# EAGLE board BlockBox (EAGLE 9.5.2), part 1 of 2
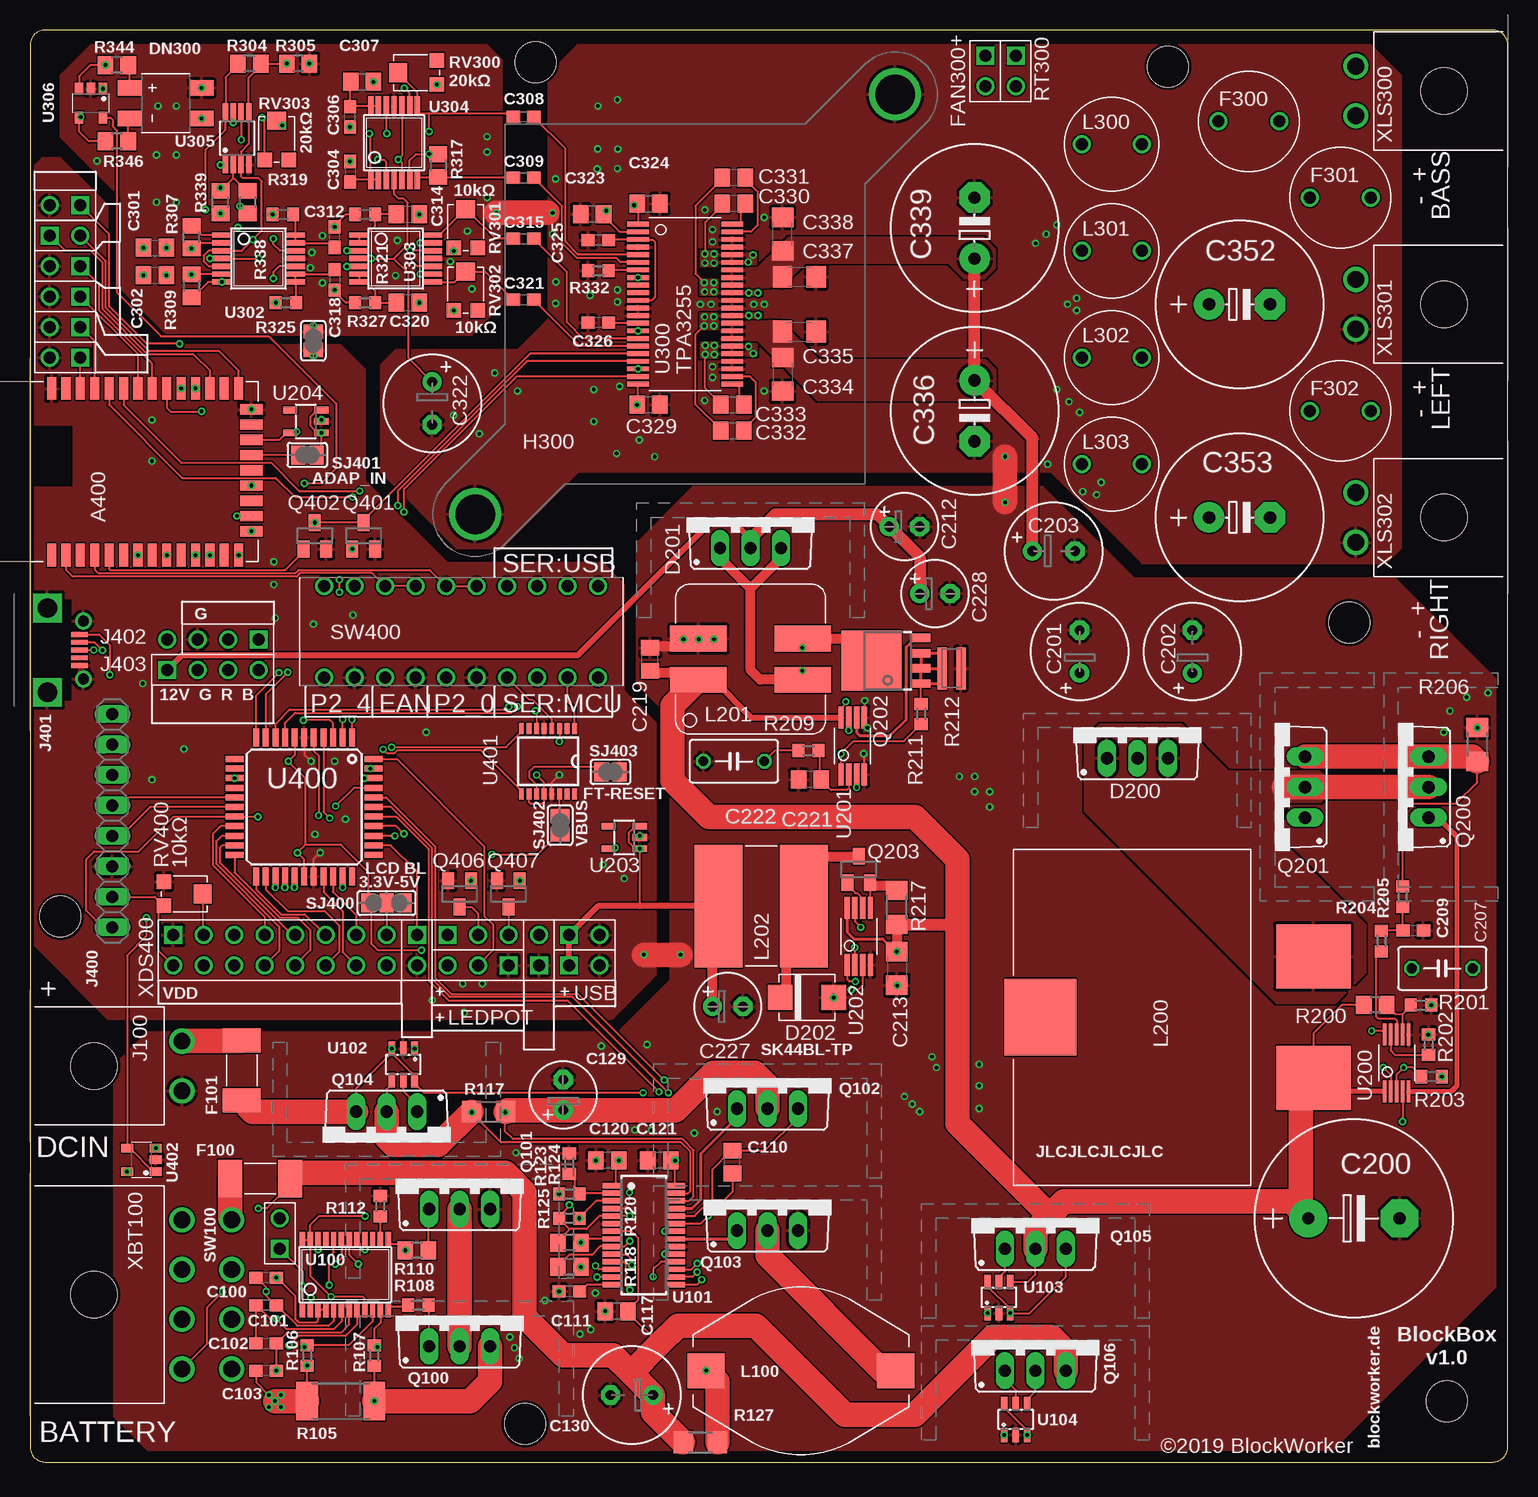
[diagram p5: board, top side]
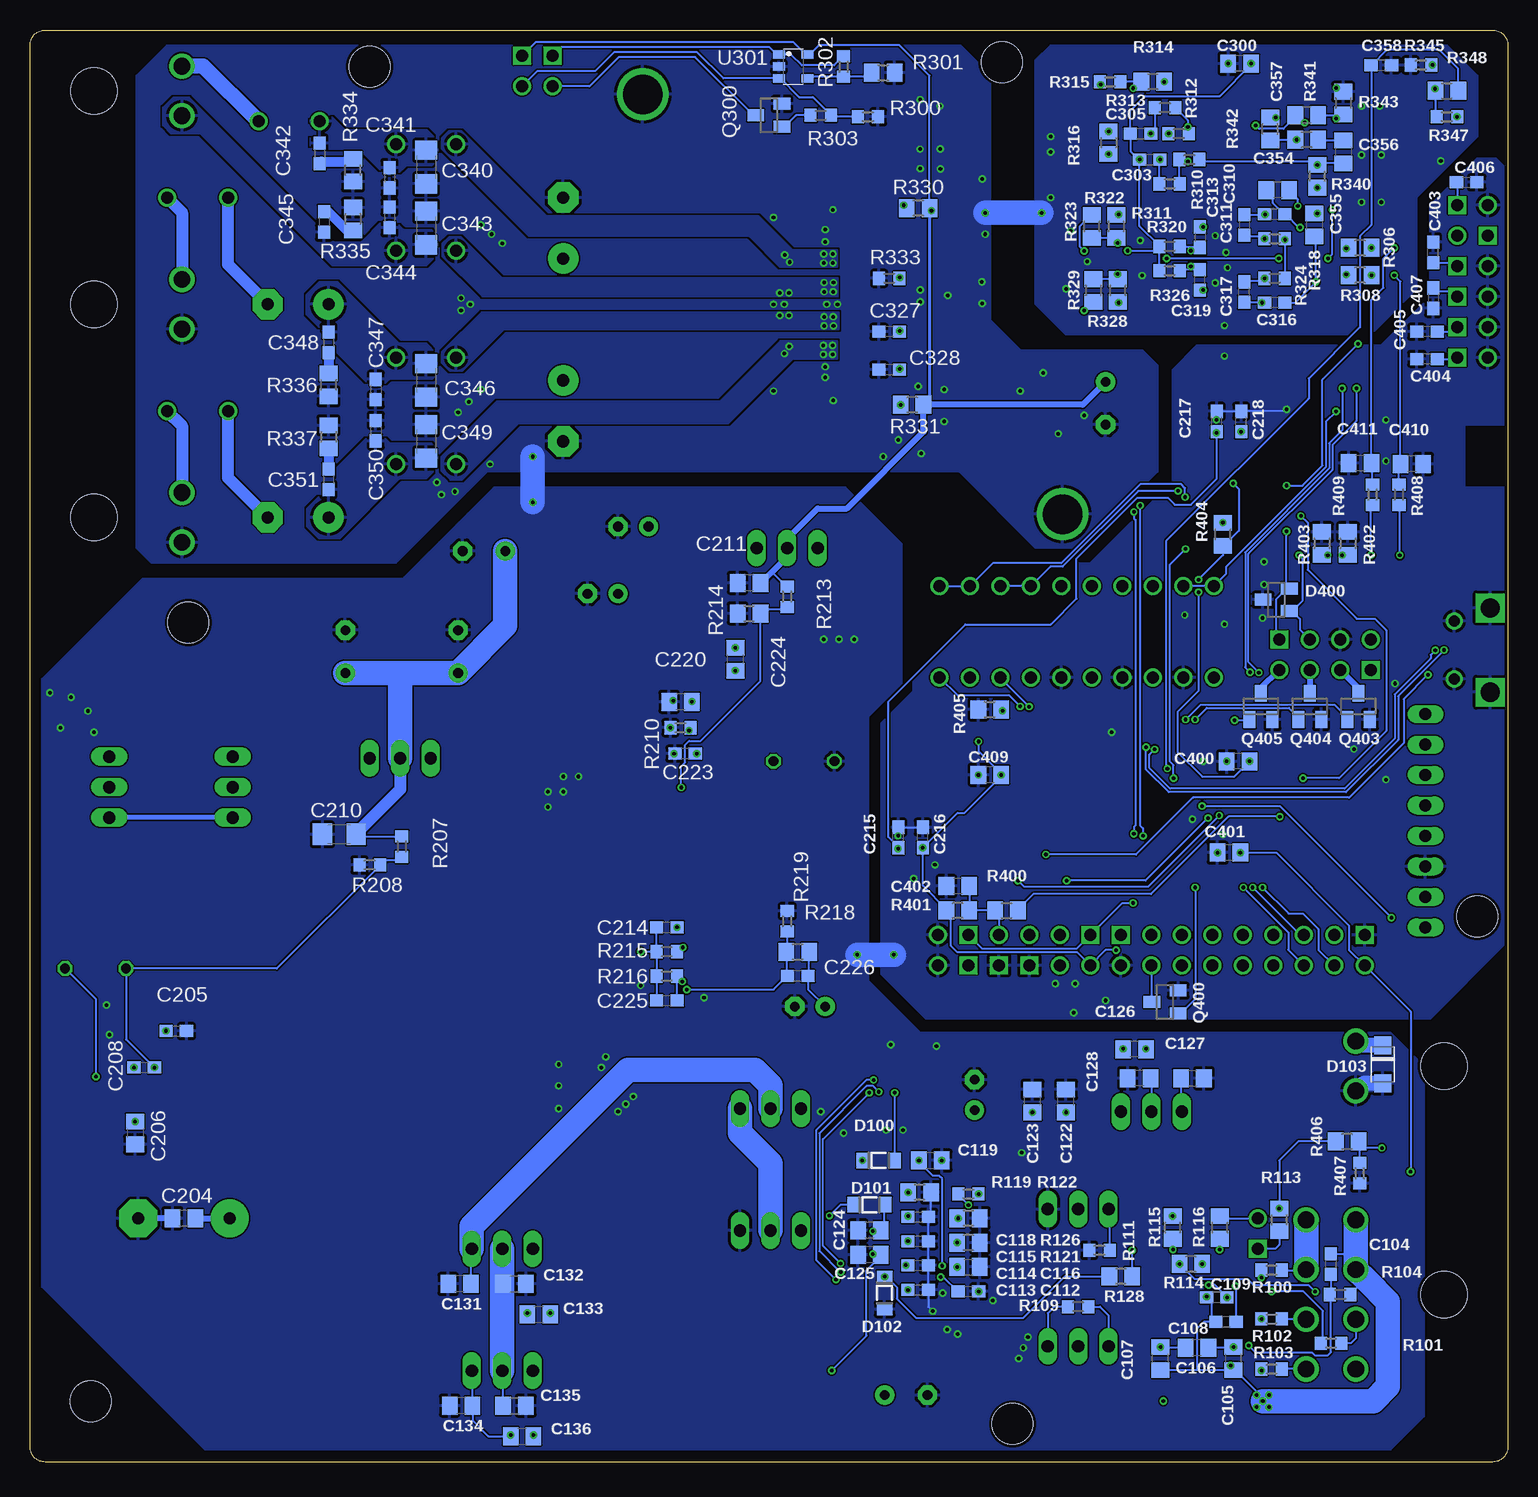
[diagram p6: board, bottom side, seen from below]

Size 123.19 x 119.38 mm. Coordinates in mm from the lower left corner, seen from the top.
Outline: 121.92,119.38 1.27,119.38 arc90 0,118.11 0,1.27 arc90 1.27,0 121.92,0 arc90 123.19,1.27 123.19,118.11 arc90 121.92,119.38
Copper layers (1*16): Top 0.035mm / dielectric 1.5mm / Bottom 0.035mm
Design rules "jlcpcb-2l": minimum track width 5mil, minimum drill 0.3mm, track to track 5mil, track to pad 5mil, pad to pad 5mil, via to via 5mil, smd to smd 0mil, copper to edge 0.25mm, drill to drill 6mil, minimum pad ring 6mil, minimum via ring 6mil, stop-mask expansion 4mil, vias tented up to drill 0.3mm, thermal gap 10mil
Holes 3.4 mm at 41.27,3.17 2.54,45.47 42.16,116.71 118.11,5.08 94.87,116.33 109.98,69.98

## Footprints (pad centres in the part's own frame; a part is rotated, then mirrored left to right if it is on the bottom)
BM62 = smd 1.9 x 0.76: 1 -6.95,-1.8; 2 -6.95,-3; 3 -6.95,-4.2; 4 -6.95,-5.4; 5 -6.95,-6.6; 6 -6.95,-7.8; 7 -6.95,-9; 8 -6.95,-10.2; 9 -6.95,-11.4; 10 -6.95,-12.6; 11 -6.95,-13.8; 12 -6.95,-15; 13 -6.95,-16.2; 14 -6.95,-17.4; 24 6.95,-17.4; 25 6.95,-16.2; 26 6.95,-15; 27 6.95,-13.8; 28 6.95,-12.6; 29 6.95,-11.4; 30 6.95,-10.2; 31 6.95,-9; 32 6.95,-7.8; 33 6.95,-6.6; 34 6.95,-5.4; 35 6.95,-4.2; 36 6.95,-3; 37 6.95,-1.8 | smd 0.85 x 1.9: 15 -4.96,-18.45; 16 -3.69,-18.45; 17 -2.42,-18.45; 18 -1.15,-18.45; 19 0.12,-18.45; 20 1.39,-18.45; 21 2.66,-18.45; 22 3.93,-18.45; 23 5.2,-18.45
C0603 = smd 1.1 x 1: 1 -0.85,0; 2 0.85,0
C0805 = smd 1.3 x 1.5: 1 -0.95,0; 2 0.95,0
E2,5-6 = drill 0.813 pad 1.6: + -1.27,0 | drill 0.813 pad 1.6 octagon: - 1.27,0
E3,5-8 = drill 0.813 pad 1.6: + -1.778,0 | drill 0.813 pad 1.6 octagon: - 1.778,0
E7,5-16 = drill 1.016 pad 3.15: + -3.81,0 | drill 1.016 pad 3.15 octagon: - 3.81,0
C050-035X075 = drill 0.813 octagon: 1 -2.54,0; 2 2.54,0
C1206 = smd 1.6 x 1.8: 1 -1.4,0; 2 1.4,0
E5-13 = drill 1.016 pad 2.54: + -2.54,0 | drill 1.016 pad 2.54 octagon: - 2.54,0
SOD323 = smd 1 x 1.3: 1 -1.35,0; 2 1.35,0
DO-219AB = smd 1.5 x 1.4: A -1.6,0; K 1.6,0
TO220ABS = drill 1.016 long: A1 -2.54,-2.54; A2 2.54,-2.54; C 0,-2.54
DO-214AA = smd 2.032 x 2.108: A -2.235,0; K 2.235,0
SOT23 = smd 1 x 1.4: 1 -0.95,-1.1; 2 0.95,-1.1; 3 0,1.1
MD-S-4 = smd 2 x 1.27: + 3,-1.27; - 3,1.27; ~1 -3,1.27; ~2 -3,-1.27
F2410 = smd 2 x 3.15: 1 -2.5,0; 2 2.5,0
MRF_FUSE = drill 1: 1 -2.54,0; 2 2.54,0
WIRE-2P-SIMPLE = drill 1 square: 1 -1.27,0 | drill 1: 2 1.27,0
ATS-CPX030030030-173-C2-R0 = drill 3.3: H1 17.5,17.5; H2 -17.5,-17.5
TE-770966 = drill 1.4: 1 -2.07,12.67; 2 2.07,12.67 | hole 3.86: 0,5.33
1X08 = drill 1 long: 1 -8.89,0; 2 -6.35,0; 3 -3.81,0; 4 -1.27,0; 5 1.27,0; 6 3.81,0; 7 6.35,0; 8 8.89,0
ZX62D-B-5PA8 = smd 0.4 x 1.35: 1 3.4,4.125; 2 4.05,4.125; 3 4.7,4.125; 4 5.35,4.125; 5 6,4.125 | drill 1.6 pad 2.375 square: S1 1.188,1.45; S2 8.213,1.45 | drill 0.9 pad 1.4: S3 2.275,4.45; S4 7.125,4.45
3PIN = drill 1 square: 1 -2.54,0 | drill 1: 2 0,0; 3 2.54,0
4PIN = drill 1 square: 1 -3.81,0 | drill 1: 2 -1.27,0; 3 1.27,0; 4 3.81,0
2PIN = drill 1 square: 1 -1.27,0 | drill 1: 2 1.27,0
PM5022 = smd 3.1 x 2.9: 1 -7.9,0; 2 7.9,0
PQ2614B = smd 5.33 x 6.2: 1 -5.075,-14.66; 2 5.075,-14.66 | smd 6.35 x 6: M 0,8.08
SRF1280A = smd 2.15 x 4.7: 1 -1.715,4.35; 2 1.715,4.35; 3 1.715,-4.35; 4 -1.715,-4.35
SRN1060 = smd 4 x 10.2: 1 -3.55,0; 2 3.55,0
RCH8011 = drill 1: 1 -2.5,0; 2 2.5,0
TO220BV = drill 1.016 long: D 0,-2.54; G -2.54,-2.54; S 2.54,-2.54
SOT669 = smd 0.7 x 1.6: 1 -1.905,-2.75; 2 -0.635,-2.75; 3 0.635,-2.75; 4 1.905,-2.75 | smd 5 x 5: MB 0,1.35
R0603 = smd 1 x 1.1: 1 -0.85,0; 2 0.85,0
R2512 = smd 1.8 x 3.2: 1 -2.8,0; 2 2.8,0
R0805 = smd 1.3 x 1.5: 1 -0.95,0; 2 0.95,0
R1206 = smd 1.6 x 1.803: 1 -1.422,0; 2 1.422,0
R0612 = smd 0.8 x 3.5: 1 -0.78,0; 2 0.78,0
TC33X-2 = smd 1.2 x 1.2: 1 -1,-1.8; 3 1,-1.8 | smd 1.6 x 1.5: 2 0,1.45
WIRE-3P-SIMPLE = drill 1 square: 1 -2.54,0 | drill 1: 2 0,0; 3 2.54,0
SJ_2 = smd 1.168 x 1.6: 1 -1.524,0; 2 0,0; 3 1.524,0
SJ = smd 1.168 x 1.6: 1 -0.762,0; 2 0.762,0
DIPSW-10 = drill 1: A1 -11.43,-3.81; A2 -8.89,-3.81; A3 -6.35,-3.81; A4 -3.81,-3.81; A5 -1.27,-3.81; A6 1.27,-3.81; A7 3.81,-3.81; A8 6.35,-3.81; A9 8.89,-3.81; A10 11.43,-3.81; B1 -11.43,3.81; B2 -8.89,3.81; B3 -6.35,3.81; B4 -3.81,3.81; B5 -1.27,3.81; B6 1.27,3.81; B7 3.81,3.81; B8 6.35,3.81; B9 8.89,3.81; B10 11.43,3.81
TSSOP24 = smd 0.45 x 1.3: 1 -3.575,-2.918; 2 -2.925,-2.918; 3 -2.275,-2.918; 4 -1.625,-2.918; 5 -0.975,-2.918; 6 -0.325,-2.918; 7 0.325,-2.918; 8 0.975,-2.918; 9 1.625,-2.918; 10 2.275,-2.918; 11 2.925,-2.918; 12 3.575,-2.918; 13 3.575,2.918; 14 2.925,2.918; 15 2.275,2.918; 16 1.625,2.918; 17 0.975,2.918; 18 0.325,2.918; 19 -0.325,2.918; 20 -0.975,2.918; 21 -1.625,2.918; 22 -2.275,2.918; 23 -2.925,2.918; 24 -3.575,2.918
QSOP28 = smd 0.45 x 1.5: 1 -4.128,-2.69; 2 -3.493,-2.69; 3 -2.857,-2.69; 4 -2.223,-2.69; 5 -1.587,-2.69; 6 -0.953,-2.69; 7 -0.318,-2.69; 8 0.318,-2.69; 9 0.953,-2.69; 10 1.587,-2.69; 11 2.223,-2.69; 12 2.857,-2.69; 13 3.493,-2.69; 14 4.128,-2.69; 15 4.128,2.69; 16 3.493,2.69; 17 2.857,2.69; 18 2.223,2.69; 19 1.587,2.69; 20 0.953,2.69; 21 0.318,2.69; 22 -0.318,2.69; 23 -0.953,2.69; 24 -1.587,2.69; 25 -2.223,2.69; 26 -2.857,2.69; 27 -3.493,2.69; 28 -4.128,2.69
SOT23-6L = smd 0.55 x 1.2: 1 -0.95,-1.3; 2 0,-1.3; 3 0.95,-1.3; 4 0.95,1.3; 5 0,1.3; 6 -0.95,1.3
VSSOP10 = smd 1.8 x 0.3: 1 -2.375,1; 2 -2.375,0.5; 3 -2.375,0; 4 -2.375,-0.5; 5 -2.375,-1; 6 2.375,-1; 7 2.375,-0.5; 8 2.375,0; 9 2.375,0.5; 10 2.375,1
VSSOP8 = smd 1.8 x 0.45: 1 -2.375,0.975; 2 -2.375,0.325; 3 -2.375,-0.325; 4 -2.375,-0.975; 5 2.375,-0.975; 6 2.375,-0.325; 7 2.375,0.325; 8 2.375,0.975
SOT23-5L = smd 0.55 x 1.2: 1 -0.95,-1.3; 2 0,-1.3; 3 0.95,-1.3; 4 0.95,1.3; 5 -0.95,1.3
TSSOP44 = smd 1.8 x 0.4: 1 -3.925,6.668; 2 -3.925,6.032; 3 -3.925,5.397; 4 -3.925,4.763; 5 -3.925,4.128; 6 -3.925,3.493; 7 -3.925,2.857; 8 -3.925,2.223; 9 -3.925,1.587; 10 -3.925,0.953; 11 -3.925,0.318; 12 -3.925,-0.318; 13 -3.925,-0.953; 14 -3.925,-1.587; 15 -3.925,-2.223; 16 -3.925,-2.857; 17 -3.925,-3.493; 18 -3.925,-4.128; 19 -3.925,-4.763; 20 -3.925,-5.397; 21 -3.925,-6.032; 22 -3.925,-6.668; 23 3.925,-6.668; 24 3.925,-6.032; 25 3.925,-5.397; 26 3.925,-4.763; 27 3.925,-4.128; 28 3.925,-3.493; 29 3.925,-2.857; 30 3.925,-2.223; 31 3.925,-1.587; 32 3.925,-0.953; 33 3.925,-0.318; 34 3.925,0.318; 35 3.925,0.953; 36 3.925,1.587; 37 3.925,2.223; 38 3.925,2.857; 39 3.925,3.493; 40 3.925,4.128; 41 3.925,4.763; 42 3.925,5.397; 43 3.925,6.032; 44 3.925,6.668
TSOP-5 = smd 0.7 x 1: 1 -0.99,-1.2; 2 0,-1.2; 3 0.99,-1.2; 4 0.99,1.2; 5 -0.99,1.2
TSSOP14 = smd 0.45 x 1.65: 1 -1.95,-3.05; 2 -1.3,-3.05; 3 -0.65,-3.05; 4 0,-3.05; 5 0.65,-3.05; 6 1.3,-3.05; 7 1.95,-3.05; 8 1.95,3.05; 9 1.3,3.05; 10 0.65,3.05; 11 0,3.05; 12 -0.65,3.05; 13 -1.3,3.05; 14 -1.95,3.05
MSOP8 = smd 0.45 x 1.45: 1 -0.975,-2.2; 2 -0.325,-2.2; 3 0.325,-2.2; 4 0.975,-2.2; 5 0.975,2.2; 6 0.325,2.2; 7 -0.325,2.2; 8 -0.975,2.2
TQFP44 = smd 1.5 x 0.5: 1 -5.8,4; 2 -5.8,3.2; 3 -5.8,2.4; 4 -5.8,1.6; 5 -5.8,0.8; 6 -5.8,0; 7 -5.8,-0.8; 8 -5.8,-1.6; 9 -5.8,-2.4; 10 -5.8,-3.2; 11 -5.8,-4; 23 5.8,-4; 24 5.8,-3.2; 25 5.8,-2.4; 26 5.8,-1.6; 27 5.8,-0.8; 28 5.8,0; 29 5.8,0.8; 30 5.8,1.6; 31 5.8,2.4; 32 5.8,3.2; 33 5.8,4 | smd 0.5 x 1.5: 12 -4,-5.8; 13 -3.2,-5.8; 14 -2.4,-5.8; 15 -1.6,-5.8; 16 -0.8,-5.8; 17 0,-5.8; 18 0.8,-5.8; 19 1.6,-5.8; 20 2.4,-5.8; 21 3.2,-5.8; 22 4,-5.8; 34 4,5.8; 35 3.2,5.8; 36 2.4,5.8; 37 1.6,5.8; 38 0.8,5.8; 39 0,5.8; 40 -0.8,5.8; 41 -1.6,5.8; 42 -2.4,5.8; 43 -3.2,5.8; 44 -4,5.8
SSOP16 = smd 0.914 x 0.406: 1 -2.718,2.223; 2 -2.718,1.587; 3 -2.718,0.953; 4 -2.718,0.318; 5 -2.718,-0.318; 6 -2.718,-0.953; 7 -2.718,-1.587; 8 -2.718,-2.223; 9 2.718,-2.223; 10 2.718,-1.587; 11 2.718,-0.953; 12 2.718,-0.318; 13 2.718,0.318; 14 2.718,0.953; 15 2.718,1.587; 16 2.718,2.223
TE-770970 = drill 1.4: 1 -6.21,16.81; 2 -2.07,16.81; 3 2.07,16.81; 4 6.21,16.81; 5 -6.21,12.67; 6 -2.07,12.67; 7 2.07,12.67; 8 6.21,12.67 | hole 3.86: 0,5.33
2X8PIN = drill 1 square: 1 -8.89,1.27 | drill 1: 2 -8.89,-1.27; 3 -6.35,1.27; 4 -6.35,-1.27; 5 -3.81,1.27; 6 -3.81,-1.27; 7 -1.27,1.27; 8 -1.27,-1.27; 9 1.27,1.27; 10 1.27,-1.27; 11 3.81,1.27; 12 3.81,-1.27; 13 6.35,1.27; 14 6.35,-1.27; 15 8.89,1.27; 16 8.89,-1.27

## Placement (x,y rotation side)
A400  BM62  [BM62]  0,82.55 90 top
C100  1µF  [C0603]  19.68,15.37 180 top
C101  1µF  [C0603]  19.68,13.08 180 top
C102  1µF  [C0603]  19.68,9.91 0 top
C103  1µF  [C0603]  19.68,7.62 180 top
C104  1µF  [C0603]  14.73,16.51 90 bottom
C105  0.1µF  [C0805]  22.86,8.64 90 bottom
C106  0.1µF  [C0805]  25.91,9.53 180 bottom
C107  0.1µF  [C0805]  28.96,8.64 90 bottom
C108  1µF  [C0603]  23.5,11.68 180 bottom
C109  1µF  [C0603]  24.26,13.72 180 bottom
C110  0.1µF  [C0805]  58.55,25.02 90 top
C111  2.2nF  [C0603]  44.96,14.22 180 top
C112  2.2nF  [C0603]  44.96,14.22 0 bottom
C113  47nF  [C0603]  49.15,14.35 0 bottom
C114  47nF  [C0603]  49.15,16.38 0 bottom
C115  1nF  [C0603]  49.15,18.41 0 bottom
C116  0.1µF  [C0805]  44.96,16.26 0 bottom
C117  0.1µF  [C0805]  48.9,12.57 180 top
C118  1µF  [C0603]  49.15,20.45 0 bottom
C119  0.1µF  [C0805]  48.13,25.15 0 bottom
C120  4.7µF  [C0805]  48.13,25.15 180 top
C121  0.1µF  [C0805]  52.45,25.15 180 top
C122  0.1µF  [C0805]  36.83,30.1 90 bottom
C123  0.1µF  [C0805]  39.62,30.1 90 bottom
C124  0.1µF  [C0805]  53.21,19.3 180 bottom
C125  0.1µF  [C0805]  53.21,17.27 180 bottom
C126  0.1µF  [C0805]  31.11,34.42 180 bottom
C127  0.1µF  [C0805]  26.29,32 0 bottom
C128  0.1µF  [C0805]  30.73,32 180 bottom
C129  47µF  [E2,5-6]  44.45,30.61 90 top
C130  220µF  [E3,5-8]  50.16,5.59 180 top
C131  0.1µF  [C0805]  87.38,14.86 180 bottom
C132  0.1µF  [C0805]  82.8,14.86 0 bottom
C133  0.1µF  [C0805]  80.77,12.32 0 bottom
C134  0.1µF  [C0805]  87.25,4.7 180 bottom
C135  0.1µF  [C0805]  82.8,4.7 0 bottom
C136  0.1µF  [C0805]  82.17,2.16 0 bottom
C200  1mF  [E7,5-16]  110.36,20.32 0 top
C201  33µF  [E3,5-8]  87.5,67.56 90 top
C202  33µF  [E3,5-8]  96.9,67.56 90 top
C203  33µF  [E3,5-8]  85.34,75.95 0 top
C204  0.1µF  [C0805]  110.36,20.32 180 bottom
C205  8.2nF  [C0603]  111,35.94 0 bottom
C206  0.1µF  [C0805]  114.43,27.43 270 bottom
C207  0.33µF  [C050-035X075]  117.73,41.15 180 top
C208  8.2nF C0G  [C0603]  113.67,32.89 0 bottom
C209  1nF  [C0603]  115.32,44.32 0 top
C210  1µF 100V  [C1206]  97.41,52.32 180 bottom
C211  0.1µF  [C0805]  63.25,73.28 180 bottom
C212  47µF  [E2,5-6]  72.9,77.98 0 top
C213  10µF 35V  [C1206]  72.26,41.15 270 top
C214  0.47µF  [C0603]  70.1,44.58 0 bottom
C215  1µF  [C0603]  50.8,52.07 90 bottom
C216  1µF  [C0603]  48.77,52.07 90 bottom
C217  1µF  [C0603]  24.26,86.74 90 bottom
C218  1µF  [C0603]  22.23,86.74 90 bottom
C219  4.7µF  [C0805]  51.69,66.93 90 top
C220  0.1µF  [C0805]  68.96,63.37 180 bottom
C221  12nF  [C0805]  65.02,56.9 180 top
C222  0.33µF  [C050-035X075]  58.67,58.42 180 top
C223  910pF  [C0603]  68.58,59.05 180 bottom
C224  4.7µF  [C0805]  64.39,66.93 90 bottom
C225  1nF  [C0603]  70.1,38.48 0 bottom
C226  1nF  [C0603]  59.18,40.51 180 bottom
C227  47µF  [E2,5-6]  58.17,37.97 0 top
C228  47µF  [E2,5-6]  75.44,72.39 0 top
C300  10µF  [C0805]  22.35,116.59 180 bottom
C301  10µF  [C0805]  10.41,101.22 0 top
C302  10µF  [C0805]  10.41,98.93 0 top
C303  330pF  [C0603]  29.84,108.58 0 bottom
C304  1nF  [C0603]  26.67,107.57 270 top
C305  100pF  [C0603]  30.61,110.74 0 bottom
C306  1nF  [C0603]  26.67,112.14 90 top
C307  10µF  [C0805]  27.69,115.06 0 top
C308  10µF  [C0603]  41.15,112.14 0 top
C309  10µF  [C0603]  41.15,107.06 0 top
C310  330pF  [C0603]  19.43,104.01 180 bottom
C311  1nF  [C0603]  21.97,103.12 270 bottom
C312  330pF  [C0603]  25.4,102.11 90 top
C313  1nF  [C0603]  25.65,102.11 270 bottom
C314  10µF  [C0805]  31.5,104.01 0 top
C315  10µF  [C0603]  41.15,101.98 0 top
C316  330pF  [C0603]  19.43,96.65 180 bottom
C317  1nF  [C0603]  21.97,97.54 90 bottom
C318  330pF  [C0603]  25.4,98.55 270 top
C319  1nF  [C0603]  25.65,98.55 90 bottom
C320  10µF  [C0805]  31.5,96.65 0 top
C321  10µF  [C0603]  41.15,96.9 0 top
C322  470µF  [E3,5-8]  33.53,88.27 270 top
C323  0.1µF  [C0805]  46.86,104.01 180 top
C324  0.1µF  [C0805]  51.56,104.9 0 top
C325  1µF  [C0603]  47.37,101.85 180 top
C326  1µF  [C0603]  47.37,95 180 top
C327  1µF  [C0603]  51.56,94.23 180 bottom
C328  1µF  [C0603]  51.56,91.06 180 bottom
C329  0.1µF  [C0805]  51.56,88.14 0 top
C330  33nF  [C0805]  58.67,104.9 180 top
C331  33nF  [C0805]  58.67,107.06 180 top
C332  33nF  [C0805]  58.55,85.98 0 top
C333  33nF  [C0805]  58.55,88.14 0 top
C334  1µF 100V .5  [C1206]  62.74,90.68 270 top
C335  1µF 100V .5  [C1206]  64.14,94.23 0 top
C336  470µF 80V  [E5-13]  78.74,87.63 270 top
C337  1µF 100V .5  [C1206]  64.14,98.81 0 top
C338  1µF 100V .5  [C1206]  62.74,102.36 90 top
C339  470µF 80V  [E5-13]  78.74,102.87 90 top
C340  1µF 100V  [C1206]  90.17,107.95 270 bottom
C341  1nF 100V  [C0603]  93.22,107.06 270 bottom
C342  10nF  [C0603]  99.06,109.09 270 bottom
C343  1µF 100V  [C1206]  90.17,102.87 270 bottom
C344  1nF 100V  [C0603]  93.22,103.76 270 bottom
C345  10nF  [C0603]  98.68,103.38 270 bottom
C346  1µF 100V  [C1206]  90.17,90.17 270 bottom
C347  1nF 100V  [C0603]  94.36,89.41 270 bottom
C348  10nF  [C0603]  98.3,93.34 270 bottom
C349  1µF 100V  [C1206]  90.17,85.09 270 bottom
C350  1nF 100V  [C0603]  94.36,85.98 270 bottom
C351  10nF  [C0603]  98.3,81.92 270 bottom
C352  470µF 80V  [E5-13]  100.84,96.52 0 top
C353  470µF 80V  [E5-13]  100.84,78.74 0 top
C354  10µF  [C0805]  19.18,106.05 180 bottom
C355  10µF  [C0805]  16.13,103.12 270 bottom
C356  10µF  [C0805]  13.72,109.22 270 bottom
C357  10µF  [C0805]  16.76,112.27 180 bottom
C358  2.2µF  [C0603]  10.54,116.46 0 bottom
C400  0.1µF  [C0805]  22.48,58.42 180 bottom
C401  0.1µF  [C0805]  23.24,50.8 180 bottom
C402  0.1µF  [C0805]  45.85,48.01 180 bottom
C403  15pF  [C0603]  6.22,100.84 90 bottom
C404  15pF  [C0603]  6.73,91.95 180 bottom
C405  15pF  [C0603]  6.73,94.23 180 bottom
C406  15pF  [C0603]  3.43,106.68 0 bottom
C407  15pF  [C0603]  6.22,97.03 270 bottom
C409  0.1µF  [C0805]  43.18,57.28 180 bottom
C410  0.1µF?  [C0805]  8,83.21 180 bottom
C411  0.1µF?  [C0805]  12.32,83.26 180 bottom
D100  NSR0530H  [SOD323]  52.45,25.15 0 bottom
D101  NSR0530H  [SOD323]  53.21,21.46 0 bottom
D102  3.9V  [SOD323]  51.94,14.1 270 bottom
D103  SMF28A-M3  [DO-219AB]  10.41,33.15 90 bottom
D200  STPS20M100ST  [TO220ABS]  92.33,61.21 0 top
D201  RB085T-60HZC9  [TO220ABS]  60.07,78.74 0 top
D202  SK44BL-TP  [DO-214AA]  64.77,38.73 180 top
D400  D5V0L2B3SO  [SOT23]  19.3,71.88 90 bottom
DN300  MD_S  [MD-S-4]  11.3,113.28 180 top
F100  15A  [F2410]  19.18,23.62 0 top
F101  10A  [F2410]  17.65,32.64 270 top
F300  2A  [MRF_FUSE]  101.6,111.76 0 top
F301  1A  [MRF_FUSE]  109.22,105.41 0 top
F302  1A  [MRF_FUSE]  109.22,87.63 0 top
FAN300  12V <50mA  [WIRE-2P-SIMPLE]  79.63,115.95 270 top
H300  ATS-CPX030030030-173-C2-R0  [ATS-CPX030030030-173-C2-R0]  54.61,96.52 0 top
J100  TE-770966  [TE-770966]  0,33.02 270 top
J400  ICSP  [1X08]  6.86,53.47 90 top
J401  ZX62D-B-5PA8  [ZX62D-B-5PA8]  0,72.39 270 top
J402  AUX  [3PIN]  16.51,68.58 180 top
J403  LED  [4PIN]  15.24,66.04 0 top
J404  SWLED  [3PIN]  37.34,43.94 0 top
J405  USB1  [2PIN]  46.23,43.94 0 top
J406  USB2  [2PIN]  46.23,41.4 0 top
L100  10µH  [PM5022]  64.26,7.62 180 top
L200  10µH  [PQ2614B]  92.33,37.08 90 top
L201  22/88µF  [SRF1280A]  60.07,66.93 90 top
L202  10µH  [SRN1060]  60.96,46.35 180 top
L300  10µH  [RCH8011]  90.17,109.86 0 top
L301  10µH  [RCH8011]  90.17,100.97 0 top
L302  15µH  [RCH8011]  90.17,92.08 0 top
L303  15µH  [RCH8011]  90.17,83.19 0 top
Q100  TK3R1E04PL  [TO220BV]  35.81,12.19 0 top
Q101  TK3R1E04PL  [TO220BV]  35.81,23.62 0 top
Q102  IPP052N06L3 G  [TO220BV]  61.47,32 0 top
Q103  IPP052N06L3 G  [TO220BV]  61.47,21.84 0 top
Q104  IPP052N06L3 G  [TO220BV]  29.72,26.67 180 top
Q105  IPP052N06L3 G  [TO220BV]  83.82,20.32 0 top
Q106  TK3R1E04PL  [TO220BV]  83.82,10.16 0 top
Q200  IRFB4510PBF  [TO220BV]  114.05,56.26 90 top
Q201  IRFB4510PBF  [TO220BV]  103.76,56.26 90 top
Q202  BUK9Y43-60E  [SOT669]  71.5,66.8 90 top
Q203  DMP4065S  [SOT23]  69.09,49.4 0 top
Q300  NMOS  [SOT23]  61.59,112.27 90 bottom
Q400  NMOS  [SOT23]  28.57,38.35 90 bottom
Q401  NMOS  [SOT23]  27.81,77.22 0 top
Q402  NMOS  [SOT23]  23.75,77.22 0 top
Q403  DMG2302UK  [SOT23]  12.45,62.99 0 bottom
Q404  DMG2302UK  [SOT23]  16.51,62.99 0 bottom
Q405  DMG2302UK  [SOT23]  20.57,62.99 0 bottom
Q406  NMOS  [SOT23]  35.81,47.37 180 top
Q407  NMOS  [SOT23]  39.88,47.37 180 top
R100  33Ω  [R0603]  19.68,16 180 bottom
R101  33Ω  [R0603]  14.73,9.91 180 bottom
R102  33Ω  [R0603]  19.68,11.94 180 bottom
R103  33Ω  [R0603]  19.68,7.75 180 bottom
R104  33Ω  [R0603]  13.97,13.97 180 bottom
R105  2mΩ  [R2512]  25.91,5.08 0 top
R106  100Ω  [R0603]  23.11,8.89 90 top
R107  100Ω  [R0603]  28.7,8.89 90 top
R108  4.53kΩ  [R0603]  32.38,13.08 180 top
R109  1MΩ  [R0603]  35.81,12.95 0 bottom
R110  1kΩ  [R0805]  32.26,17.65 180 top
R111  1MΩ  [R0603]  34.04,17.65 0 bottom
R112  470kΩ  [R0603]  29.21,21.34 270 top
R113  1kΩ  [R0805]  19.05,20.19 90 bottom
R114  10kΩ  [R0805]  26.42,16.51 180 bottom
R115  10kΩ  [R0805]  27.94,19.56 90 bottom
R116  10kΩ  [R0805]  24,19.56 90 bottom
R117  5mΩ  [R1206]  38.23,29.21 180 top
R118  10kΩ  [R0805]  44.96,16.26 180 top
R119  10kΩ  [R0805]  49.02,22.48 180 bottom
R120  100kΩ  [R0805]  44.96,18.29 180 top
R121  100kΩ  [R0805]  44.96,18.29 180 bottom
R122  20kΩ  [R0603]  44.96,22.35 180 bottom
R123  30kΩ  [R0603]  44.96,22.35 180 top
R124  30kΩ  [R0603]  44.96,24.89 270 top
R125  30kΩ  [R0603]  44.96,20.32 180 top
R126  10kΩ  [R0805]  44.96,20.32 180 bottom
R127  10mΩ  [R1206]  55.88,1.65 180 top
R128  10kΩ  [R0805]  32.26,15.49 180 bottom
R200  10kΩ  [R0805]  112.14,38.1 180 top
R201  1.69kΩ  [R0603]  115.95,38.1 180 top
R202  86.6kΩ  [R0603]  116.59,34.8 270 top
R203  237Ω  [R0603]  116.84,32.13 0 top
R204  3.57kΩ  [R0603]  112.65,43.43 90 top
R205  100Ω  [R0603]  114.43,47.12 90 top
R206  8mΩ  [R1206]  120.65,59.82 270 top
R207  23.2kΩ  [R0603]  92.2,51.31 90 bottom
R208  576Ω  [R0603]  94.87,49.78 0 bottom
R209  324Ω  [R0603]  64.9,59.31 0 top
R210  48.7kΩ  [R0603]  68.96,61.21 180 bottom
R211  100Ω  [R0603]  74.3,62.36 90 top
R212  15mΩ  [R0612]  76.83,66.17 180 top
R213  84.5kΩ  [R0603]  60.07,72.14 90 bottom
R214  10kΩ  [R0805]  63.25,70.74 0 bottom
R215  44.2kΩ  [R0603]  70.1,42.55 180 bottom
R216  1.43kΩ  [R0603]  70.1,40.51 180 bottom
R217  10mΩ  [R1206]  72.26,46.23 270 top
R218  10kΩ  [R0805]  59.18,42.55 0 bottom
R219  3.32kΩ  [R0603]  60.07,45.09 270 bottom
R300  510Ω  [R0603]  53.34,112.14 180 bottom
R301  10kΩ  [R0805]  52.07,115.82 0 bottom
R302  39kΩ  [R0603]  55.37,116.33 90 bottom
R303  47Ω?  [R0603]  57.28,112.27 180 bottom
R304  10kΩ  [R0805]  18.29,116.59 180 top
R305  10kΩ  [R0805]  22.35,116.59 180 top
R306  10kΩ  [R0805]  12.32,101.22 180 bottom
R307  10kΩ  [R0805]  13.46,102.11 90 top
R308  10kΩ  [R0805]  12.32,98.93 180 bottom
R309  10kΩ  [R0805]  13.46,98.04 270 top
R310  200kΩ  [R0603]  26.54,108.58 180 bottom
R311  24.3kΩ  [R0603]  28.19,106.55 180 bottom
R312  237kΩ  [R0603]  27.43,110.74 0 bottom
R313  66.5kΩ  [R0603]  28.57,112.9 180 bottom
R314  10kΩ  [R0805]  29.59,115.06 180 bottom
R315  4.53kΩ  [R0603]  33.15,115.06 180 bottom
R316  10kΩ  [R0805]  33.27,109.98 270 bottom
R317  10kΩ  [R0805]  34.04,108.08 270 top
R318  86.6kΩ  [R0603]  19.43,101.98 180 bottom
R319  54.9kΩ  [R0603]  21.08,104.01 0 top
R320  210kΩ  [R0603]  28.19,101.35 0 bottom
R321  22.6kΩ  [R0603]  27.94,104.01 0 top
R322  10kΩ  [R0805]  32.64,103 270 bottom
R323  10kΩ  [R0805]  34.67,103 90 bottom
R324  86.6kΩ  [R0603]  19.43,98.68 180 bottom
R325  54.9kΩ  [R0603]  21.34,96.65 0 top
R326  210kΩ  [R0603]  28.19,99.31 0 bottom
R327  22.6kΩ  [R0603]  27.94,96.65 0 top
R328  10kΩ  [R0805]  32.51,97.66 90 bottom
R329  10kΩ  [R0805]  34.54,97.66 270 bottom
R330  3.3Ω  [R0805]  49.15,104.52 180 bottom
R331  3.3Ω  [R0805]  49.66,88.14 180 bottom
R332  64.9kΩ  [R0603]  47.37,99.31 0 top
R333  30kΩ  [R0603]  51.56,98.68 0 bottom
R334  3.3Ω  [R0805]  96.27,107.7 90 bottom
R335  3.3Ω  [R0805]  96.27,103.63 270 bottom
R336  3.3Ω  [R0805]  98.3,89.79 90 bottom
R337  3.3Ω  [R0805]  98.3,85.47 270 bottom
R338  10kΩ  [R0805]  18.16,105.03 90 top
R339  10kΩ  [R0805]  15.88,105.03 90 top
R340  10kΩ  [R0805]  15.88,107.19 90 bottom
R341  10kΩ  [R0805]  16.76,110.24 180 bottom
R342  1kΩ  [R0805]  19.81,111.12 90 bottom
R343  10kΩ  [R0805]  13.72,113.28 270 bottom
R344  10kΩ  [R0805]  7.24,116.46 180 top
R345  20kΩ  [R0603]  7.24,116.46 0 bottom
R346  10kΩ  [R0805]  7.24,110.11 180 top
R347  20kΩ  [R0603]  5.08,112.14 180 bottom
R348  10kΩ  [R0805]  5.08,114.3 0 bottom
R400  330Ω  [R0805]  41.78,45.97 0 bottom
R401  10kΩ  [R0805]  45.85,45.97 180 bottom
R402  10kΩ  [R0805]  13.34,76.58 270 bottom
R403  10kΩ  [R0805]  15.49,76.58 270 bottom
R404  10kΩ  [R0805]  23.75,77.34 90 bottom
R405  10kΩ  [R0805]  43.18,62.74 0 bottom
R406  10kΩ  [R0805]  13.39,26.72 180 bottom
R407  1.69kΩ  [R0603]  12.34,24.08 90 bottom
R408  47Ω?  [R0603]  9.07,80.64 270 bottom
R409  47Ω?  [R0603]  11.28,80.64 270 bottom
RT300  103AT  [WIRE-2P-SIMPLE]  82.17,115.95 270 top
RV300  20kΩ  [TC33X-2]  32.13,115.82 90 top
RV301  10kΩ  [TC33X-2]  36.32,103 0 top
RV302  10kΩ  [TC33X-2]  36.32,97.79 0 top
RV303  20kΩ  [TC33X-2]  20.57,110.36 0 top
RV400  10kΩ  [TC33X-2]  12.95,47.37 270 top
RV401  100kΩ  [WIRE-3P-SIMPLE]  37.34,41.4 180 top
SJ400  3.3V-5V  [SJ_2]  29.72,46.61 0 top
SJ401  ADAP  [SJ]  23.11,83.95 180 top
SJ402  VBUS  [SJ]  44.2,53.09 90 top
SJ403  FTRESET  [SJ]  48.39,57.53 180 top
SJ404  GND CUT  [SJ]  23.62,93.47 90 top
SW100  PWRSW  [WIRE-2P-SIMPLE]  20.83,19.05 90 top
SW400  DIPSW-SPDT-5  [DIPSW-10]  35.94,69.22 180 top
SW401  MFB  [WIRE-2P-SIMPLE]  2.92,102.23 0 top
SW402  BTN1  [WIRE-2P-SIMPLE]  2.92,99.69 180 top
SW403  BTN2  [WIRE-2P-SIMPLE]  2.92,92.08 180 top
SW404  BTN3  [WIRE-2P-SIMPLE]  2.92,94.61 180 top
SW405  BTN4  [WIRE-2P-SIMPLE]  2.92,104.78 180 top
SW406  BTN5  [WIRE-2P-SIMPLE]  2.92,97.16 180 top
SW407  RESET  [WIRE-2P-SIMPLE]  42.42,42.67 90 top
SW408  LCDBL  [WIRE-2P-SIMPLE]  32.26,42.67 270 top
U100  BQ77915  [TSSOP24]  26.29,15.62 0 top
U101  MAX1737  [QSOP28]  51.18,18.92 270 top
U102  LM74700-Q1  [SOT23-6L]  31.11,33.15 180 top
U103  LM74700-Q1  [SOT23-6L]  80.77,13.72 0 top
U104  LM74700-Q1  [SOT23-6L]  82.17,3.56 0 top
U200  LM5022  [VSSOP10]  113.92,33.27 90 top
U201  LM3488  [VSSOP8]  68.58,59.69 90 top
U202  LM25085  [VSSOP8]  69.09,43.81 90 top
U203  LDO-3.3V  [SOT23-5L]  49.53,52.07 90 top
U204  LDO-3.8V  [SOT23-5L]  22.99,86.74 90 top
U300  TPA3255  [TSSOP44]  54.61,96.52 0 top
U301  NCS20071  [TSOP-5]  59.56,116.33 270 bottom
U302  LM2902  [TSSOP14]  19.05,100.33 270 top
U303  LM2902  [TSSOP14]  30.48,100.33 270 top
U304  LM2902  [TSSOP14]  30.35,109.98 0 top
U305  LM2904  [MSOP8]  17.27,110.36 0 top
U306  NCS20071  [TSOP-5]  5.08,113.28 180 top
U400  PIC18LF4_K42  [TQFP44]  22.86,54.61 270 top
U401  FT230XS  [SSOP16]  43.18,58.42 270 top
U402  NCS20071  [TSOP-5]  9.3,25.2 90 top
XBT100  4S4P Li-ion + 103AT  [TE-770970]  0,13.97 270 top
XDS400  HD44780_LCD-CON  [2X8PIN]  20.83,42.67 0 top
XLS300  BASS  [TE-770966]  123.19,114.3 90 top
XLS301  LEFT  [TE-770966]  123.19,96.52 90 top
XLS302  RIGHT  [TE-770966]  123.19,78.74 90 top